# Altium schematic sheet Current_Sensing.SchDoc
size A
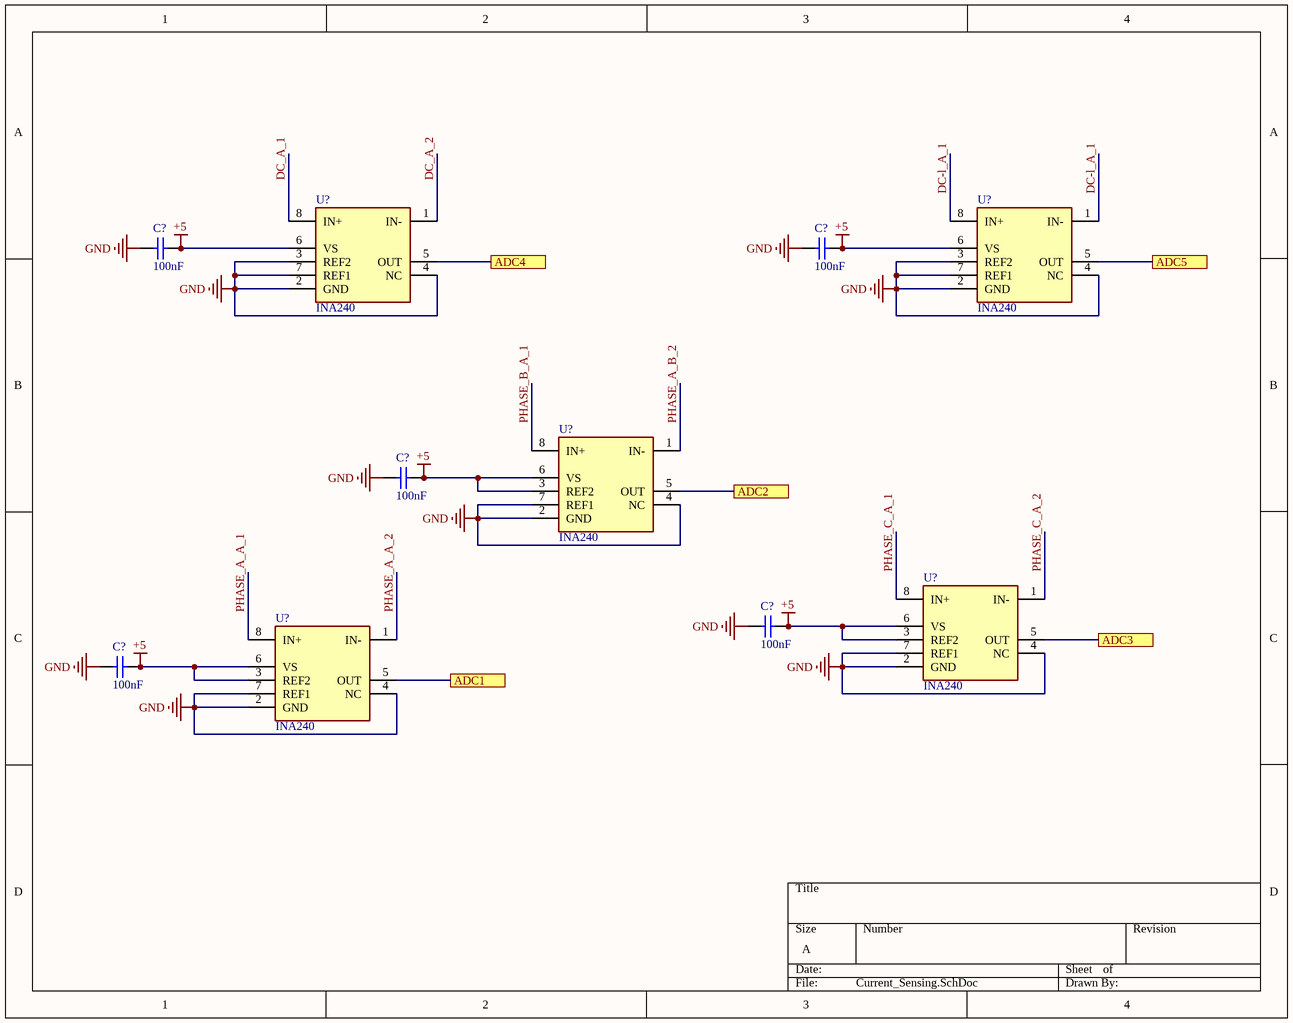
[diagram p0: Current_Sensing.SchDoc]

## Parts
(Parts that share a designator on the sheet are numbered #1, #2 ... from top to bottom, then left to right.)
C?#1  value 100nF  [C0805]  (hidden comment: 10V)
C?#2  value 100nF  [C0805]  (hidden comment: 10V)
C?#3  value 100nF  [C0805]  (hidden comment: 10V)
C?#4  value 100nF  [C0805]  (hidden comment: 10V)
C?#5  value 100nF  [C0805]  (hidden comment: 10V)
U?#1  INA240  [INA240]
U?#2  INA240  [INA240]
U?#3  INA240  [INA240]
U?#4  INA240  [INA240]
U?#5  INA240  [INA240]

## Ports
ADC1, ADC2, ADC3, ADC4, ADC5

## Nets
+5: C?#1.2 C?#2.2 C?#3.2 C?#4.2 C?#5.2 U?#1.6(VS) U?#2.6(VS) U?#3.3(REF2) U?#3.6(VS) U?#4.3(REF2) U?#4.6(VS) U?#5.3(REF2) U?#5.6(VS)
GND: C?#1.1 C?#2.1 C?#3.1 C?#4.1 C?#5.1 U?#1.2(GND) U?#1.3(REF2) U?#1.4(NC) U?#1.7(REF1) U?#2.2(GND) U?#2.3(REF2) U?#2.4(NC) U?#2.7(REF1) U?#3.2(GND) U?#3.4(NC) U?#3.7(REF1) U?#4.2(GND) U?#4.4(NC) U?#4.7(REF1) U?#5.2(GND) U?#5.4(NC) U?#5.7(REF1)
ADC1: U?#5.5(OUT) ; port ADC1
ADC2: U?#3.5(OUT) ; port ADC2
ADC3: U?#4.5(OUT) ; port ADC3
ADC4: U?#1.5(OUT) ; port ADC4
ADC5: U?#2.5(OUT) ; port ADC5
DC-l_A_1: U?#2.1(IN-) U?#2.8(IN+)
DC_A_1: U?#1.8(IN+)
DC_A_2: U?#1.1(IN-)
PHASE_A_A_1: U?#5.8(IN+)
PHASE_A_A_2: U?#5.1(IN-)
PHASE_A_B_2: U?#3.1(IN-)
PHASE_B_A_1: U?#3.8(IN+)
PHASE_C_A_1: U?#4.8(IN+)
PHASE_C_A_2: U?#4.1(IN-)

## Library data of the parts
C?#1-C?#5 = Cap: C0805C104K8RACTU. 0.1µF ±10% 10V Ceramic Capacitor X7R 0805 (2012 Metric) /; Published: 8-Jun-2000; LatestRevisionDate: 17-Jul-2002; LatestRevisionNote: Re-released for DXP Platform.; PackageReference: RAD-0.3; Publisher: Altium Limited; PackageDescription: Radial Cap, Thru-Hole; 2 Leads; 0.3 in Pin Spacing
U?#1-U?#5 = INA240: -4V to 80V Current Sense Amplifier; Manufacturer: Texas Instruments; Manufacturer Part Number: INA240A2DR; Datasheet: https://www.ti.com/lit/ds/sbos662b/sbos662b.pdf; Supplier Part Number: 296-51173-1-ND; Supplier: Digikey